# EAGLE design p10 control (EAGLE 8.5.1)
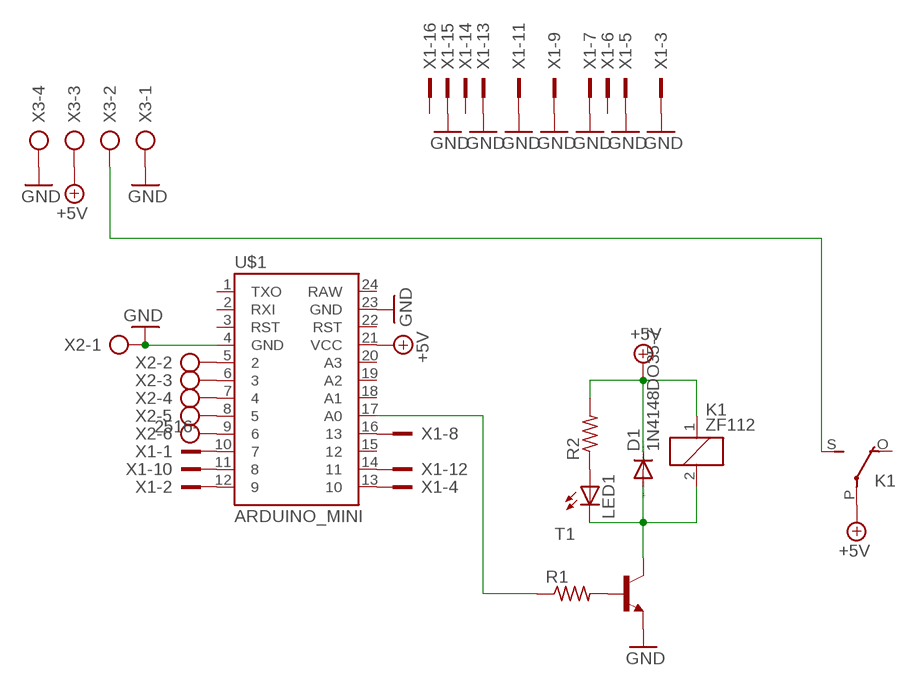
[diagram p0: schematic, sheet 1]

## Parts
D1  1N4148DO35-7  [DO35-7]
K1  ZF112  [ZF112]
LED1  LED3MM  [LED3MM]
R1  R-US_0207/7  [0207/7]
R2  R-US_0207/10  [0207/10]
T1  2N3904-NPN-TO92-EBC  [TO92-EBC]
U$1  ARDUINO_MINI  [ARDUINO_MINI]
X1  2516-  [PAK100/2500-16]
X2  AK500/6  [AK500/6]
X3  AK500/4  [AK500/4]

## Nets
+5V: D1.C K1.1 K1.P(2:P) R2.2 U$1.21(VCC) X3.3
GND: T1.E U$1.4(GND) U$1.23(GND) X1.3 X1.5 X1.7 X1.9 X1.11 X1.13 X1.15 X2.1 X3.1 X3.4
N$1: R1.2 T1.B
N$2: U$1.13 X1.4
N$3: U$1.16 X1.8
N$4: U$1.11 X1.10
N$5: U$1.14 X1.12
N$6: U$1.12 X1.2
N$7: U$1.10 X1.1
N$8: U$1.9 X2.6
N$9: U$1.8 X2.5
N$10: U$1.7 X2.4
N$11: U$1.6 X2.3
N$12: U$1.5 X2.2
N$13: LED1.A R2.1
N$14: D1.A K1.2 LED1.K(C) T1.C
N$15: R1.1 U$1.17(A0)
N$16: K1.S(2:S) X3.2
Unconnected: K1.O(2:O) U$1.1(TXO) U$1.2(RXI) U$1.3(RST) U$1.15 U$1.18(A1) U$1.19(A2) U$1.20(A3) U$1.22(RST) U$1.24(RAW) X1.6 X1.14 X1.16

## Library data of the parts
D1 = diode:1N4148: DIODE high speed (Philips)
K1 = relay:ZF112: RELAY 1 x switch; OC_FARNELL: unknown; OC_NEWARK: unknown
LED1 = led:LED: LED OSRAM: - CHIPLED LG R971, LG N971, LY N971, LG Q971, LY Q971, LO R971, LY R971 LH N974, LH R974 LS Q976, LO Q976, LY Q976 LO Q996 - Hyper CHIPLED LW Q18S LB Q993, LB Q99A, LB R99A - SideLED LS A670, LO A670, LY A670, LG A670, LP A670 LB A673, LV A673, LT A673, LW A673 LH A674 LY A675 LS A676, LA A676, LO A676, LY A676, LW A676 LS A679, LY A679, LG A679 - Hyper Micro SIDELED® LS Y876, LA Y876, LO Y876, LY Y876 LT Y87S - SmartLED LW L88C, LW L88S LB L89C, LB L89S, LG L890 LS L89K, LO L89K, LY L89K LS L896, LA L896, LO L896, LY L896 - TOPLED LS T670, LO T670, LY T670, LG T670, LP T670 LSG T670, LSP T670, LSY T670, LOP T670, LYG T670 LG T671, LOG T671, LSG T671 LB T673, LV T673, LT T673, LW T673 LH T674 LS T676, LA T676, LO T676, LY T676, LB T676, LH T676, LSB T676, LW T676 LB T67C, LV T67C, LT T67C, LS T67K, LO T67K, LY T67K, LW E67C LS E67B, LA E67B, LO E67B, LY E67B, LB E67C, LV E67C, LT E67C LW T67C LS T679, LY T679, LG T679 LS T770, LO T770, LY T770, LG T770, LP T770 LB T773, LV T773, LT T773, LW T773 LH T774 LS E675, LA E675, LY E675, LS T675 LS T776, LA T776, LO T776, LY T776, LB T776 LHGB T686 LT T68C, LB T68C - Hyper Mini TOPLED® LB M676 - Mini TOPLED Santana® LG M470 LS M47K, LO M47K, LY M47K Source: http://www.osram.convergy.de LUXEON: - LUMILED® LXK2-PW12-R00, LXK2-PW12-S00, LXK2-PW14-U00, LXK2-PW14-V00 LXK2-PM12-R00, LXK2-PM12-S00, LXK2-PM14-U00 LXK2-PE12-Q00, LXK2-PE12-R00, LXK2-PE12-S00, LXK2-PE14-T00, LXK2-PE14-U00 LXK2-PB12-K00, LXK2-PB12-L00, LXK2-PB12-M00, LXK2-PB14-N00, LXK2-PB14-P00, LXK2-PB14-Q00 LXK2-PR12-L00, LXK2-PR12-M00, LXK2-PR14-Q00, LXK2-PR14-R00 LXK2-PD12-Q00, LXK2-PD12-R00, LXK2-PD12-S00 LXK2-PH12-R00, LXK2-PH12-S00 LXK2-PL12-P00, LXK2-PL12-Q00, LXK2-PL12-R00 Source: www.luxeon.com KINGBRIGHT: KA-3528ASYC Source: www.kingbright.com
R1 R2 = rcl:R-US_: RESISTOR, American symbol; SPICEPREFIX: R
T1 = transistor-neu-to92:*-NPN-: NPN Transistror
U$1 = SparkFun-Retired:ARDUINO_MINI: Arduino Pro Mini footprint
X1 = con-3m:2516-: 3M (TM) Pak 100 4-Wall Header Source: 3M; OC_FARNELL: unknown; OC_NEWARK: unknown
X2 = con-ptr500:AK500/6: CONNECTOR; OC_FARNELL: unknown; OC_NEWARK: unknown
X3 = con-ptr500:AK500/4: CONNECTOR; OC_FARNELL: unknown; OC_NEWARK: unknown

## Board
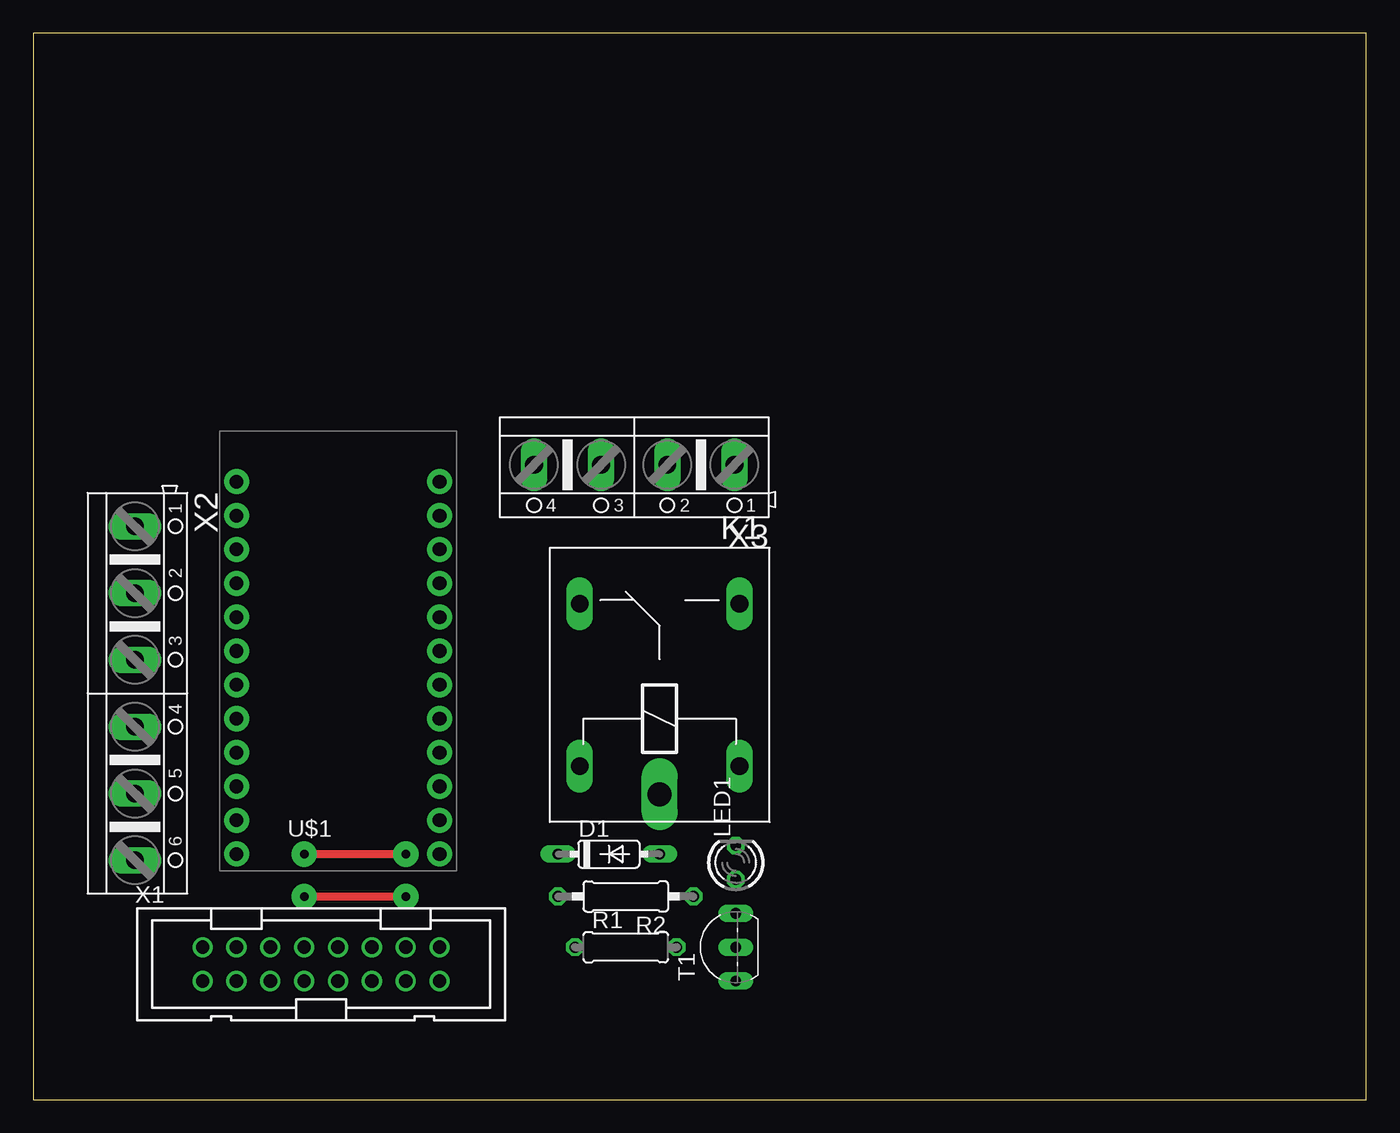
[diagram p1: board, top side]
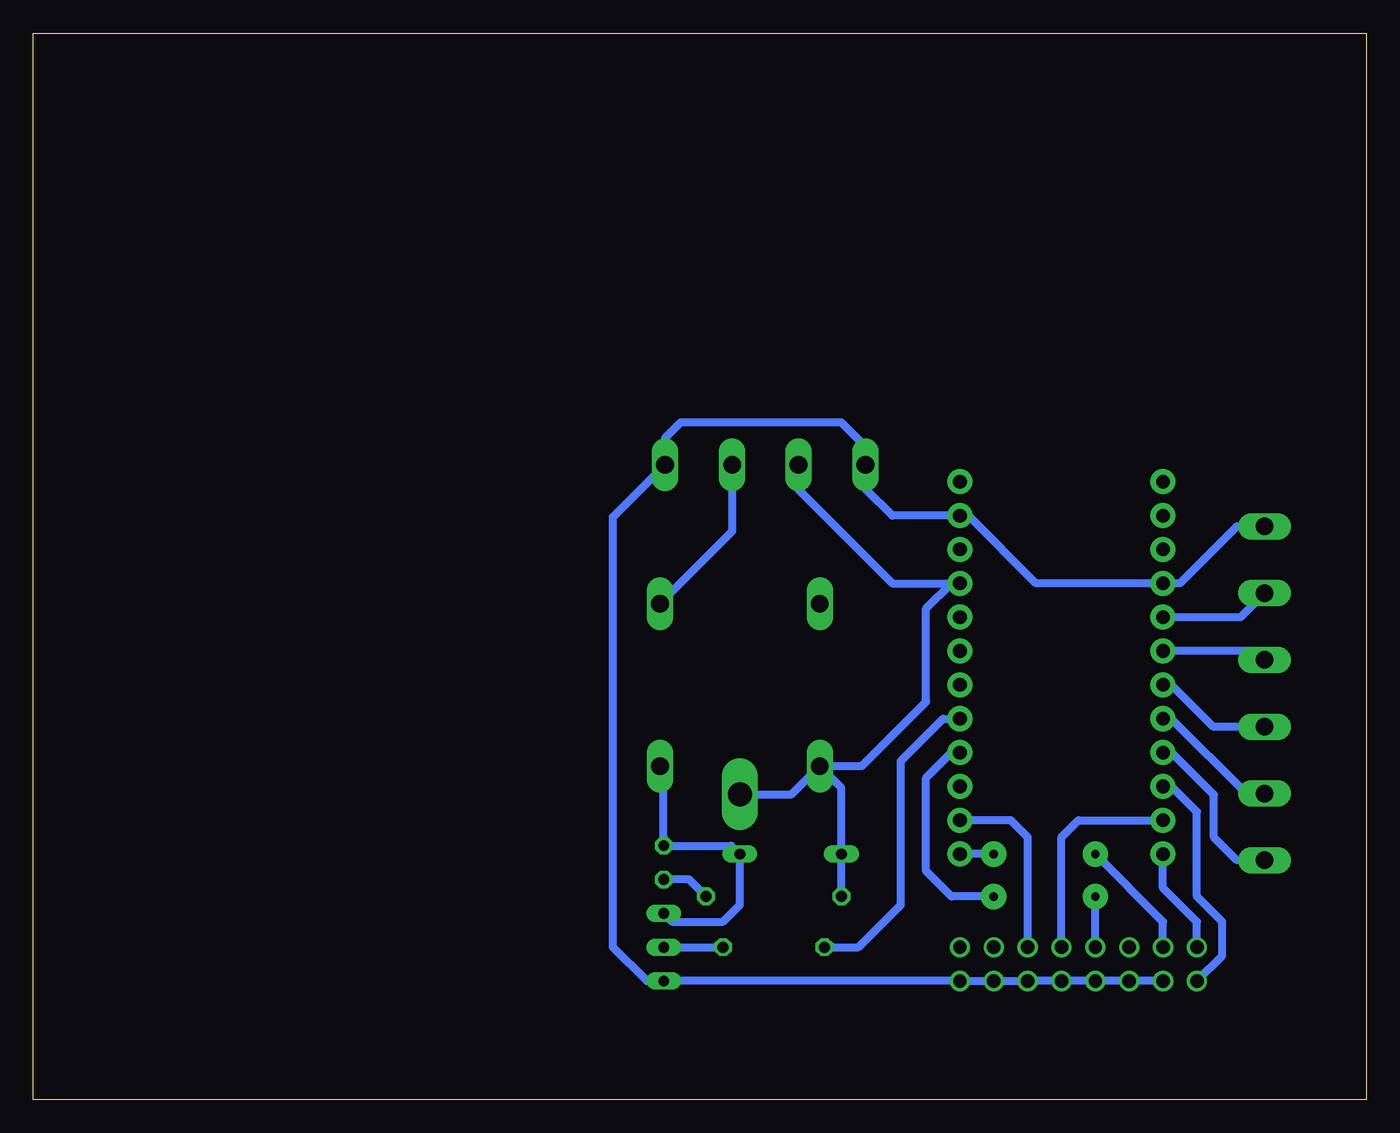
[diagram p2: board, bottom side, seen from below]

Size 100 x 80 mm. Coordinates in mm from the lower left corner, seen from the top.
Outline: 0,0 100,0 100,80 0,80 0,0
Copper layers (1*16): Top 0.035mm / dielectric 1.5mm / Bottom 0.035mm
Design rules "default": minimum track width 6mil, minimum drill 0.35mm, track to track 6mil, track to pad 6mil, pad to pad 6mil, via to via 6mil, smd to smd 6mil, copper to edge 40mil, drill to drill 6mil, minimum pad ring 10mil, minimum via ring 8mil, stop-mask expansion 4mil, vias tented up to drill 0mil, thermal gap 10mil

### Footprints (pad centres in the part's own frame; a part is rotated, then mirrored left to right if it is on the bottom)
DO35-7 = drill 0.813 long: A 3.81,0; C -3.81,0
ZF112 = drill 1.321 long: 1 -6.096,5.994; 2 -6.096,-5.994; O 6.096,5.994; S 6.096,-5.994 | drill 1.803 long: P -8.204,0
LED3MM = drill 0.813 octagon: A -1.27,0; K 1.27,0
0207/7 = drill 0.813 octagon: 1 -3.81,0; 2 3.81,0
0207/10 = drill 0.813 octagon: 1 -5.08,0; 2 5.08,0
TO92-EBC = drill 0.813 long: B 0,-1.27; C 2.54,-1.27; E -2.54,-1.27
ARDUINO_MINI = drill 1.016 pad 1.88: 1 -7.62,12.7; 2 -7.62,10.16; 3 -7.62,7.62; 4 -7.62,5.08; 5 -7.62,2.54; 6 -7.62,0; 7 -7.62,-2.54; 8 -7.62,-5.08; 9 -7.62,-7.62; 10 -7.62,-10.16; 11 -7.62,-12.7; 12 -7.62,-15.24; 13 7.62,-15.24; 14 7.62,-12.7; 15 7.62,-10.16; 16 7.62,-7.62; 17 7.62,-5.08; 18 7.62,-2.54; 19 7.62,0; 20 7.62,2.54; 21 7.62,5.08; 22 7.62,7.62; 23 7.62,10.16; 24 7.62,12.7
PAK100/2500-16 = drill 1 pad 1.422: 1 -8.89,-1.27; 2 -8.89,1.27; 3 -6.35,-1.27; 4 -6.35,1.27; 5 -3.81,-1.27; 6 -3.81,1.27; 7 -1.27,-1.27; 8 -1.27,1.27; 9 1.27,-1.27; 10 1.27,1.27; 11 3.81,-1.27; 12 3.81,1.27; 13 6.35,-1.27; 14 6.35,1.27; 15 8.89,-1.27; 16 8.89,1.27
AK500/6 = drill 1.321 long: 1 -12.522,0; 2 -7.518,0; 3 -2.515,0; 4 2.515,0; 5 7.518,0; 6 12.522,0
AK500/4 = drill 1.321 long: 1 -7.518,0; 2 -2.489,0; 3 2.489,0; 4 7.518,0

### Placement (x,y rotation side)
D1  43.18,18.41 0 top
K1  46.99,31.11 90 top
LED1  52.7,17.78 90 top
R1  44.45,11.43 0 top
R2  44.45,15.24 180 top
T1  51.44,11.43 90 top
U$1  22.86,33.66 0 top
X1  21.59,10.16 0 top
X2  7.62,30.48 270 top
X3  45.09,47.62 180 top

### Tracks (layer width: path | path; a pad name or v marks a point on that pad's centre or on a via)
+5V
  Bottom 0.61: R2.2 D1.C 39.37,23.39 K1.1 | K1.1 37.85,25.02 33.02,29.84 33.02,36.83 31.11,38.73 U$1.21 35.56,38.73 42.6,45.77 X3.3 | K1.P 43.1,22.91 K1.1
GND
  Bottom 0.61: X2.1 9.7,43 13.97,38.73 U$1.4 24.77,38.73 29.84,43.81 U$1.23 35.56,43.81 37.57,45.82 X3.4 37.57,49 39.37,50.8 51.44,50.8 52.6,49.63 X3.1 56.52,43.71 56.52,11.43 53.98,8.89 T1.E X1.15 X1.13 X1.11 X1.9 X1.7 X1.5 X1.3
N$1
  Bottom 0.61: T1.B R1.2
N$2  (via drill 0.64 pad 1.91)
  Top 0.61: v20.32,18.41 v27.94,18.41
  Bottom 0.61: X1.4 15.24,13.34 v20.32,18.41 | v27.94,18.41 U$1.13
N$3  (via drill 0.64 pad 1.91)
  Top 0.61: v20.32,15.24 v27.94,15.24
  Bottom 0.61: X1.8 v20.32,15.24 | v27.94,15.24 31.11,15.24 33.02,17.14 33.02,24.13 31.11,26.04 U$1.16
N$4
  Bottom 0.61: X1.10 22.86,19.68 21.59,20.95 U$1.11
N$5
  Bottom 0.61: X1.12 25.4,19.68 26.67,20.95 U$1.14
N$6
  Bottom 0.61: X1.2 12.7,13.34 15.24,15.88 U$1.12
N$7
  Bottom 0.61: X1.1 10.79,10.79 10.79,13.34 12.7,15.24 12.7,21.59 14.61,23.5 U$1.10
N$8
  Bottom 0.61: X2.6 9.7,17.96 11.43,19.68 11.43,22.86 14.61,26.04 U$1.9
N$9
  Bottom 0.61: X2.5 8.99,22.96 14.61,28.57 U$1.8
N$10
  Bottom 0.61: X2.4 11.46,27.96 14.61,31.11 U$1.7
N$11
  Bottom 0.61: X2.3 8.28,33.66 U$1.6
N$12
  Bottom 0.61: U$1.5 9.42,36.2 X2.2
N$13
  Bottom 0.61: R2.1 50.8,16.51 LED1.A
N$14
  Bottom 0.61: K1.2 52.7,24.74 LED1.K 47.62,19.05 D1.A 46.99,14.61 48.26,13.34 52.07,13.34 T1.C
N$15
  Bottom 0.61: U$1.17 31.75,28.57 34.92,25.4 34.92,14.61 38.1,11.43 R1.1
N$16
  Bottom 0.61: X3.2 47.57,42.62 K1.S